# EAGLE design G853X (EAGLE 6.6.0)
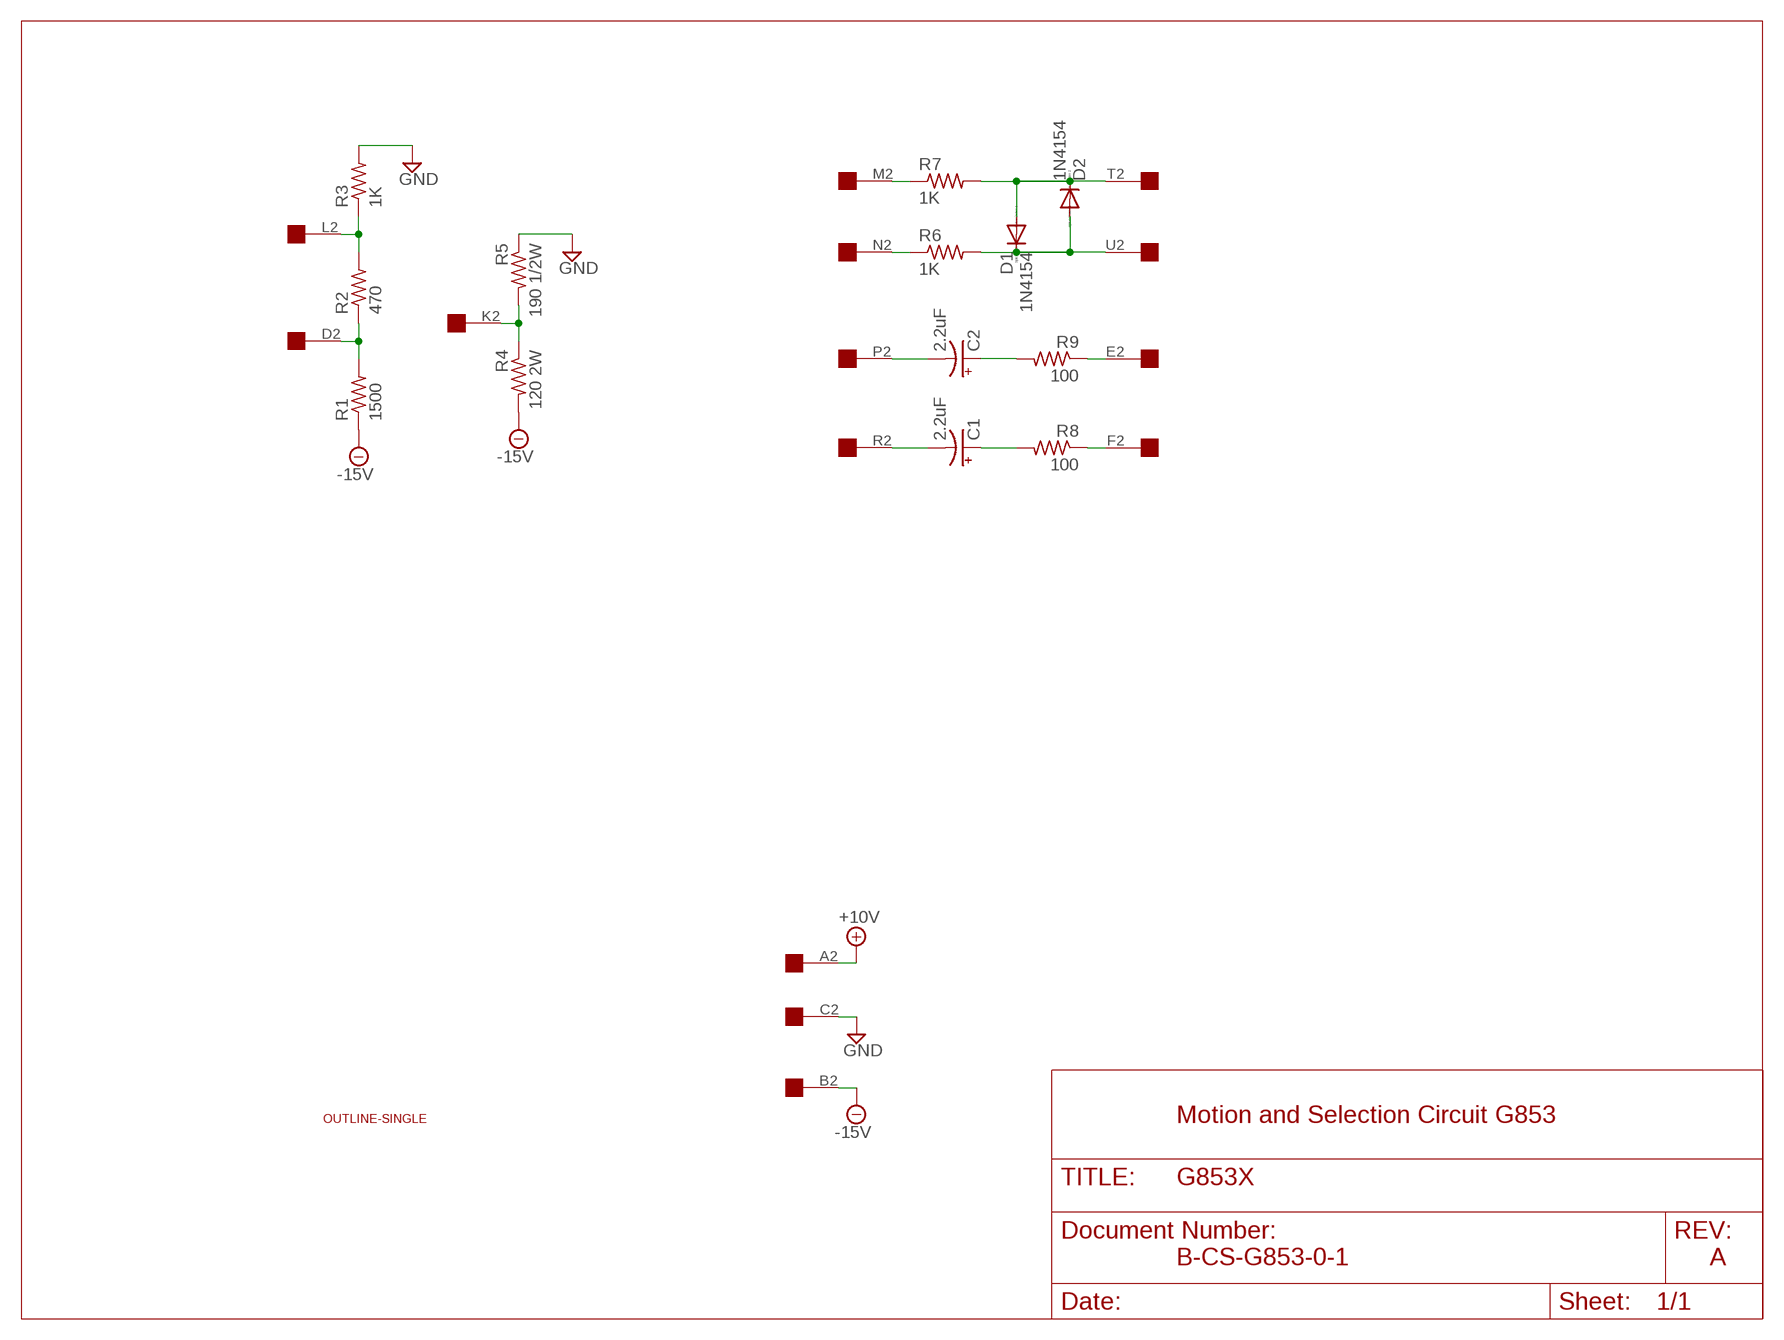
[diagram p0: schematic, sheet 1]

## Parts
C1  2.2uF  CPOL-USE15-5AXIAL  [E15-5]
C2  2.2uF  CPOL-USE15-5AXIAL  [E15-5]
D1  1N4154  1N4148DO35-10  [DO35-10]
D2  1N4154  1N4148DO35-10  [DO35-10]
R1  1500  R-US_0207/10  [0207/10]
R2  470  R-US_0207/10  [0207/10]
R3  1K  R-US_0207/10  [0207/10]
R4  120 2W  R-US_0817/22  [P0817/22]
R5  190 1/2W  R-US_0309/12  [0309/12]
R6  1K  R-US_0207/10  [0207/10]
R7  1K  R-US_0207/10  [0207/10]
R8  100  R-US_0207/10  [0207/10]
R9  100  R-US_0207/10  [0207/10]
U$1  OUTLINE-SINGLE  [SINGLE]
U$2  EDGE-1  [EDGE-CON1]

## Nets
+10V [Supply]: U$2.A2
-15V [Supply]: R1.1 R4.2 U$2.B2
GND [Supply]: R3.2 R5.1 U$2.C2
N$1 [Supply]: C1.- U$2.R2
N$2 [Supply]: C1.+ R8.2
N$3 [Supply]: R1.2 R2.1 U$2.D2
N$4 [Supply]: R6.1 U$2.N2
N$5 [Supply]: R7.1 U$2.M2
N$6 [Supply]: D1.A D2.C R7.2 U$2.T2
N$7 [Supply]: D1.C D2.A R6.2 U$2.U2
N$8 [Supply]: R2.2 R3.1 U$2.L2
N$9 [Supply]: C2.+ R9.2
N$10 [Supply]: C2.- U$2.P2
N$11 [Supply]: R8.1 U$2.F2
N$12 [Supply]: R9.1 U$2.E2
N$13 [Supply]: R4.1 R5.2 U$2.K2
Unconnected: U$2.H2 U$2.J2 U$2.S2 U$2.V2

## Notes on the sheet
- Motion and Selection Circuit G853
- B-CS-G853-0-1 | A

## Library data of the parts
C1 C2 = rcl:CPOL-US: POLARIZED CAPACITOR, American symbol
D1 D2 = diode:1N4148: DIODE high speed (Philips)
R1-R9 = rcl:R-US_: RESISTOR, American symbol
U$1 = dec-con:OUTLINE-*: Board outlines for DEC boards.
U$2 = dec-con:EDGE-1: Single-Sided DEC Edge Connector -- (side 2)

## Net classes
1 Supply: width 0.813 mm

## Board
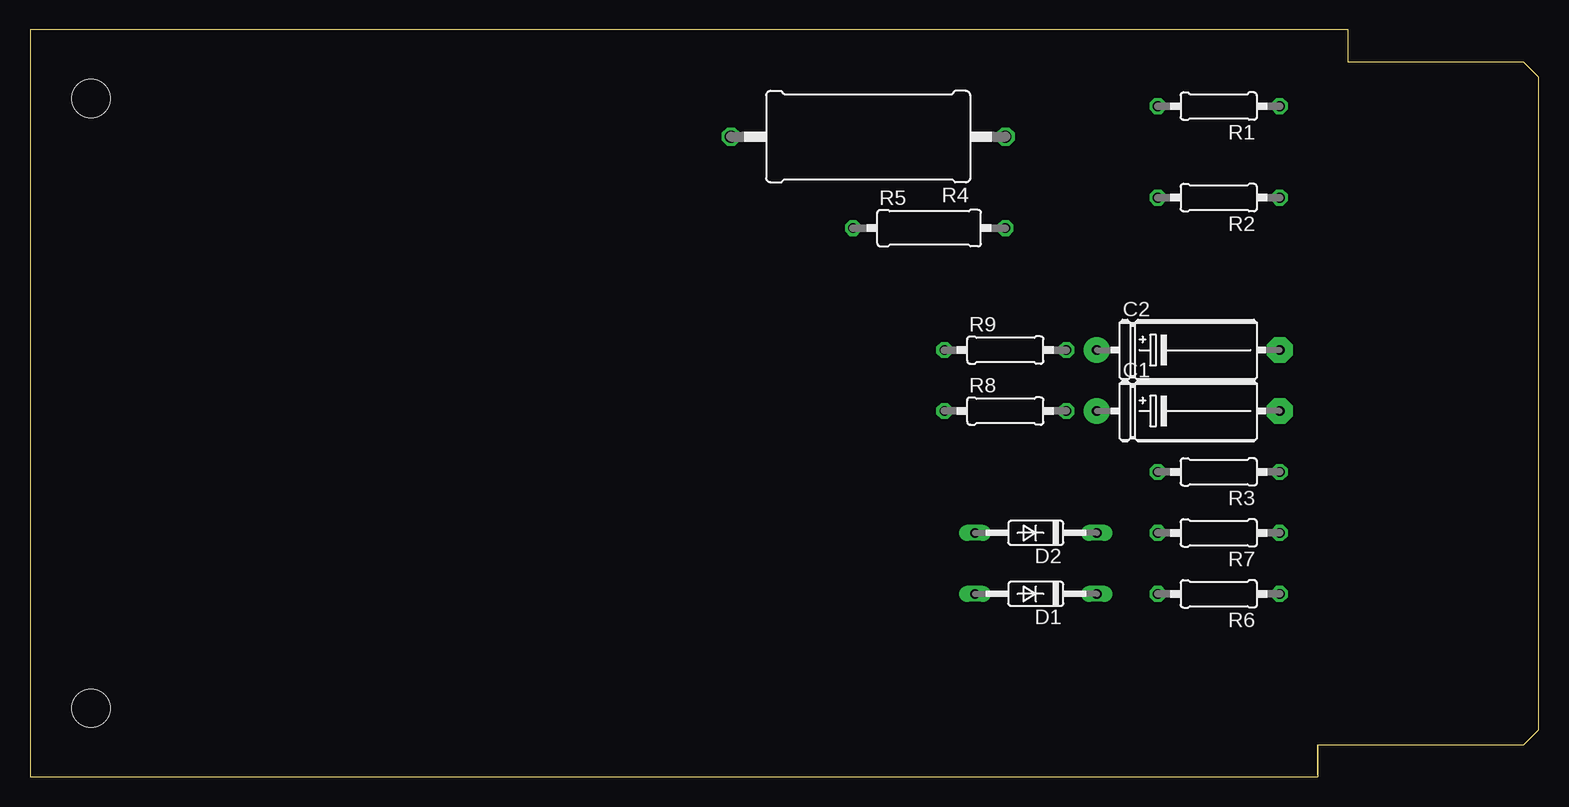
[diagram p1: board, top side]
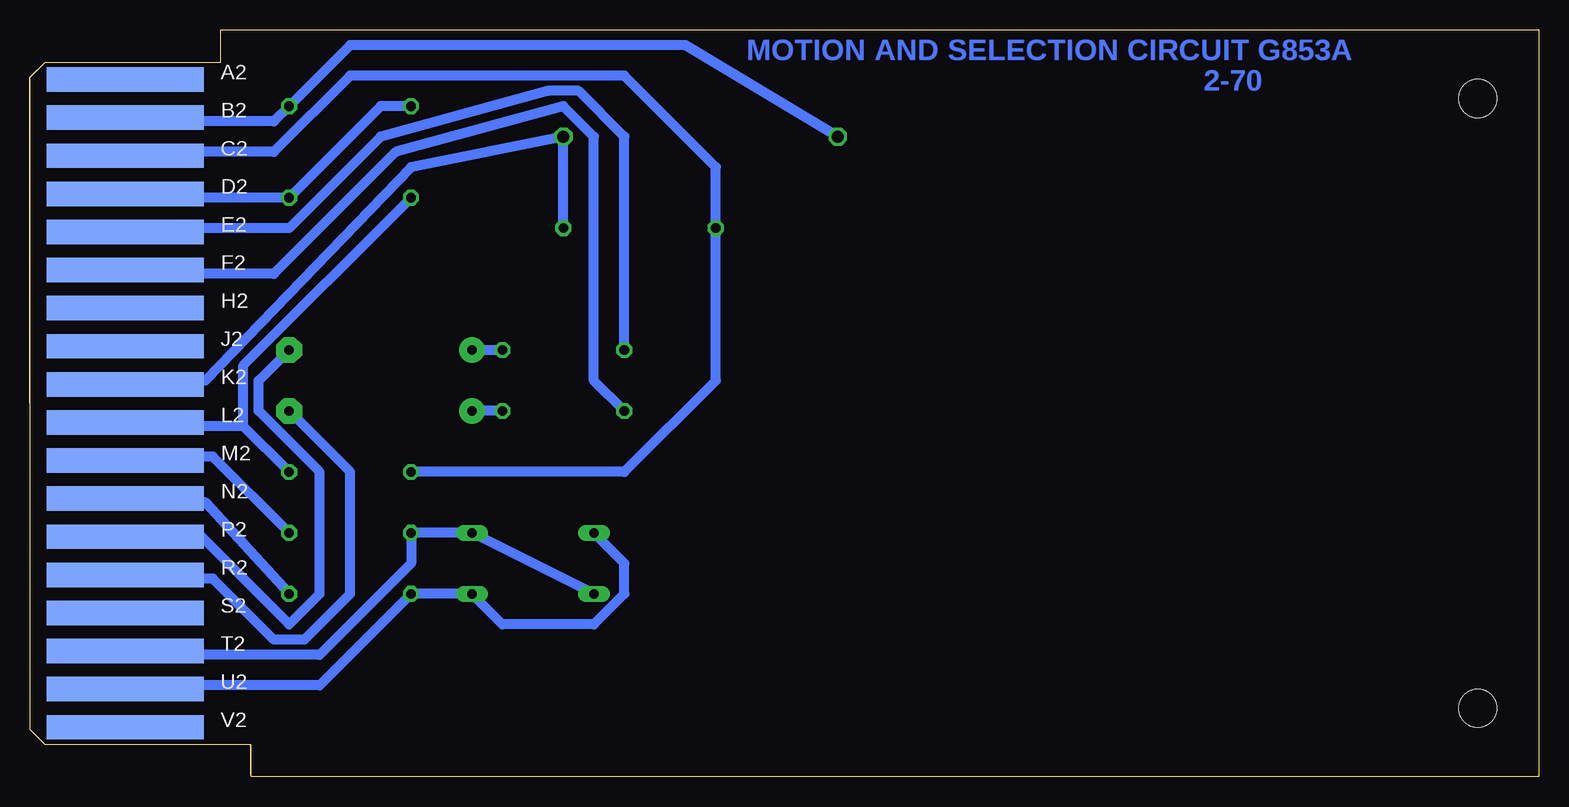
[diagram p2: board, bottom side, seen from below]

Size 125.73 x 62.23 mm. Coordinates in mm from the lower left corner, seen from the top.
Copper layers (1+16): Top 0.035mm / dielectric 1.5mm / Bottom 0.035mm
Design rules "16mils": minimum track width 16mil, minimum drill 32mil, track to track 15mil, track to pad 10mil, pad to pad 10mil, via to via 10mil, smd to smd 10mil, copper to edge 13mil, drill to drill 10mil, minimum pad ring 10mil, minimum via ring 8mil, stop-mask expansion 0mil, vias tented up to drill 0mil, thermal gap 10mil

### Footprints (pad centres in the part's own frame; a part is rotated, then mirrored left to right if it is on the bottom)
E15-5 = drill 0.813 pad 2.159: + -7.62,0 | drill 0.813 pad 2.159 octagon: - 7.62,0
DO35-10 = drill 0.813 long: A 5.08,0; C -5.08,0
0207/10 = drill 0.813 octagon: 1 -5.08,0; 2 5.08,0
P0817/22 = drill 1.016 octagon: 1 -11.43,0; 2 11.43,0
0309/12 = drill 0.813 octagon: 1 -6.35,0; 2 6.35,0
SINGLE = hole 3.175: 120.65,56.515; 120.65,5.715
EDGE-CON1 = smd 13.106 x 2.032 bottom: A2 7.938,4.128; B2 7.938,7.303; C2 7.938,10.477; D2 7.938,13.652; E2 7.938,16.828; F2 7.938,20.003; H2 7.938,23.177; J2 7.938,26.352; K2 7.938,29.527; L2 7.938,32.703; M2 7.938,35.877; N2 7.938,39.053; P2 7.938,42.227; R2 7.938,45.403; S2 7.938,48.578; T2 7.938,51.752; U2 7.938,54.928; V2 7.938,58.102

### Placement (x,y rotation side)
C1  96.52,30.48 0 top
C2  96.52,35.56 0 top
D1  83.82,15.24 180 top
D2  83.82,20.32 180 top
R1  99.06,55.88 180 top
R2  99.06,48.26 180 top
R3  99.06,25.4 180 top
R4  69.85,53.34 180 top
R5  74.93,45.72 0 top
R6  99.06,15.24 180 top
R7  99.06,20.32 180 top
R8  81.28,30.48 0 top
R9  81.28,35.56 0 top
U$1  125.73,62.23 180 top
U$2  125.73,62.23 180 top

### Tracks (layer width: path | path; a pad name or v marks a point on that pad's centre or on a via)
-15V
  Bottom 0.813: U$2.B2 117.13,54.9 116.84,54.61 105.41,54.61 R1.1 99.06,60.96 71.12,60.96 R4.2
GND
  Bottom 0.813: U$2.C2 117.17,51.74 116.84,52.07 105.41,52.07 99.06,58.42 76.2,58.42 68.58,50.8 R5.1 68.58,33.02 76.2,25.4 R3.2
N$1
  Bottom 0.813: U$2.R2 117.17,16.84 116.84,16.51 110.49,16.51 105.41,11.43 102.87,11.43 99.06,15.24 99.06,25.4 C1.-
N$2
  Bottom 0.813: R8.2 C1.+
N$3
  Bottom 0.813: U$2.D2 117.14,48.56 116.84,48.26 R2.1 96.52,55.88 R1.2
N$4
  Bottom 0.813: U$2.N2 117.17,23.19 116.84,22.86 111.12,22.86 R6.1
N$5
  Bottom 0.813: U$2.M2 117.17,26.34 116.84,26.67 110.49,26.67 R7.1
N$6
  Bottom 0.813: U$2.T2 117.17,10.49 116.84,10.16 101.6,10.16 93.98,17.78 R7.2 D2.C D1.A
N$7
  Bottom 0.813: U$2.U2 117.2,7.26 116.84,7.62 101.6,7.62 R6.2 D1.C 86.36,12.7 78.74,12.7 76.2,15.24 76.2,17.78 D2.A
N$8
  Bottom 0.813: U$2.L2 117.17,29.54 116.84,29.21 107.95,29.21 | R3.1 107.95,29.21 | 107.95,29.21 107.95,34.29 R2.2
N$9
  Bottom 0.813: R9.2 C2.+
N$10
  Bottom 0.813: C2.- 106.68,33.02 106.68,30.48 101.6,25.4 101.6,15.24 104.14,12.7 111.76,20.32 116.84,20.32 117.17,19.99 U$2.P2
N$11
  Bottom 0.813: R8.1 78.74,33.02 78.74,53.34 81.28,55.88 95.25,52.07 105.41,41.91 116.84,41.91 117.12,42.19 U$2.F2
N$12
  Bottom 0.813: U$2.E2 117.17,45.39 116.84,45.72 104.14,45.72 96.52,53.34 82.55,57.15 80.01,57.15 76.2,53.34 R9.1
N$13
  Bottom 0.813: U$2.K2 117.14,32.72 116.84,33.02 111.12,33.02 93.98,50.8 R4.1 R5.2

### Text on the board
Bottom: MOTION AND SELECTION CIRCUIT G853A | 2-70